# EAGLE design 48-pin (EAGLE 6.4)
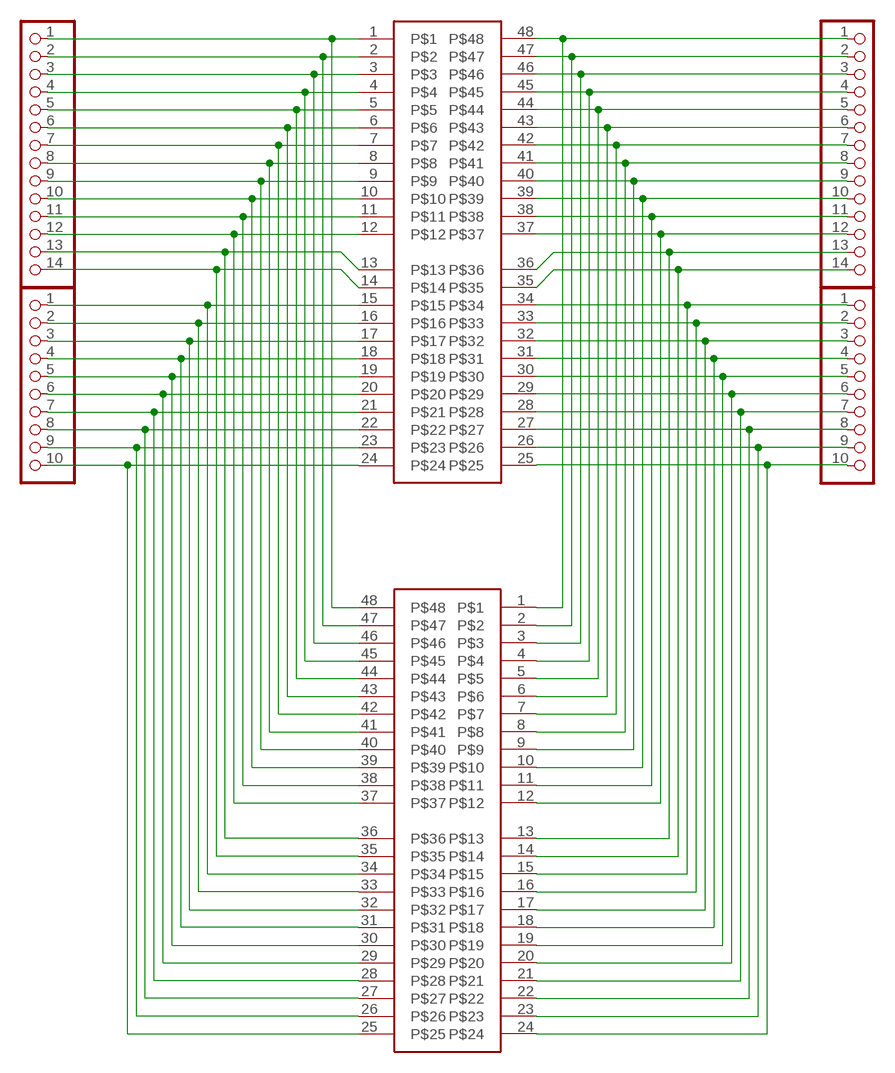
[diagram p0: schematic, sheet 1]

## Parts
JP1  PADS-14  [PADS-14]
JP2  PADS-14  [PADS-14]
JP3  PADS-10  [PADS-10]
JP4  PADS-10  [PADS-10]
U$1  BREAKOUTS_48-PINTQFP  [BREAKOUTS_TQFP48]
U$2  BREAKOUTS_48-PINQFN  [BREAKOUTS_QFN48]

## Nets
.05: JP4.6 U$1.29 U$2.20
N$1: JP1.1 U$1.1 U$2.48
N$2: JP1.2 U$1.2 U$2.47
N$3: JP1.3 U$1.3 U$2.46
N$4: JP1.4 U$1.4 U$2.45
N$5: JP1.5 U$1.5 U$2.44
N$6: JP1.6 U$1.6 U$2.43
N$7: JP1.7 U$1.7 U$2.42
N$8: JP1.8 U$1.8 U$2.41
N$9: JP1.9 U$1.9 U$2.40
N$10: JP1.10 U$1.10 U$2.39
N$11: JP1.11 U$1.11 U$2.38
N$12: JP1.12 U$1.12 U$2.37
N$13: JP3.1 U$1.15 U$2.34
N$14: JP3.2 U$1.16 U$2.33
N$15: JP3.3 U$1.17 U$2.32
N$16: JP3.4 U$1.18 U$2.31
N$17: JP3.5 U$1.19 U$2.30
N$18: JP3.6 U$1.20 U$2.29
N$19: JP3.7 U$1.21 U$2.28
N$20: JP3.8 U$1.22 U$2.27
N$21: JP3.9 U$1.23 U$2.26
N$22: JP3.10 U$1.24 U$2.25
N$23: JP2.1 U$1.48 U$2.1
N$24: JP2.2 U$1.47 U$2.2
N$25: JP2.3 U$1.46 U$2.3
N$26: JP2.4 U$1.45 U$2.4
N$27: JP2.5 U$1.44 U$2.5
N$28: JP2.6 U$1.43 U$2.6
N$29: JP2.7 U$1.42 U$2.7
N$30: JP2.8 U$1.41 U$2.8
N$32: JP2.10 U$1.39 U$2.10
N$33: JP2.11 U$1.38 U$2.11
N$34: JP2.12 U$1.37 U$2.12
N$35: JP4.1 U$1.34 U$2.15
N$36: JP4.2 U$1.33 U$2.16
N$37: JP4.3 U$1.32 U$2.17
N$38: JP4.4 U$1.31 U$2.18
N$39: JP4.5 U$1.30 U$2.19
N$41: JP4.7 U$1.28 U$2.21
N$42: JP4.8 U$1.27 U$2.22
N$43: JP4.9 U$1.26 U$2.23
N$44: JP4.10 U$1.25 U$2.24
N$45: JP1.14 U$1.14 U$2.35
N$46: JP2.14 U$1.35 U$2.14
N$47: JP2.13 U$1.36 U$2.13
N$48: JP1.13 U$1.13 U$2.36
N$49: JP2.9 U$1.40 U$2.9

## Library data of the parts
JP1 JP2 = breakouts:PADS-14: PIN HEADER
JP3 JP4 = breakouts:PADS-10: PIN HEADER
U$1 U$2 = fpp48-pin:BREAKOUTS_48-PIN

## Board
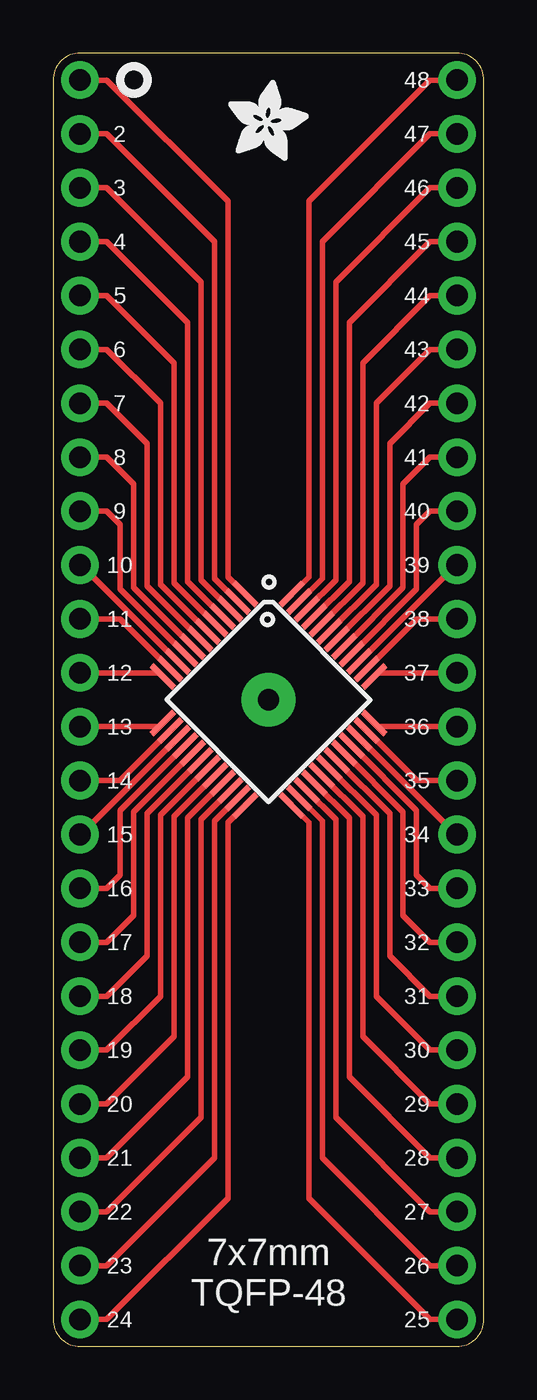
[diagram p1: board, top side]
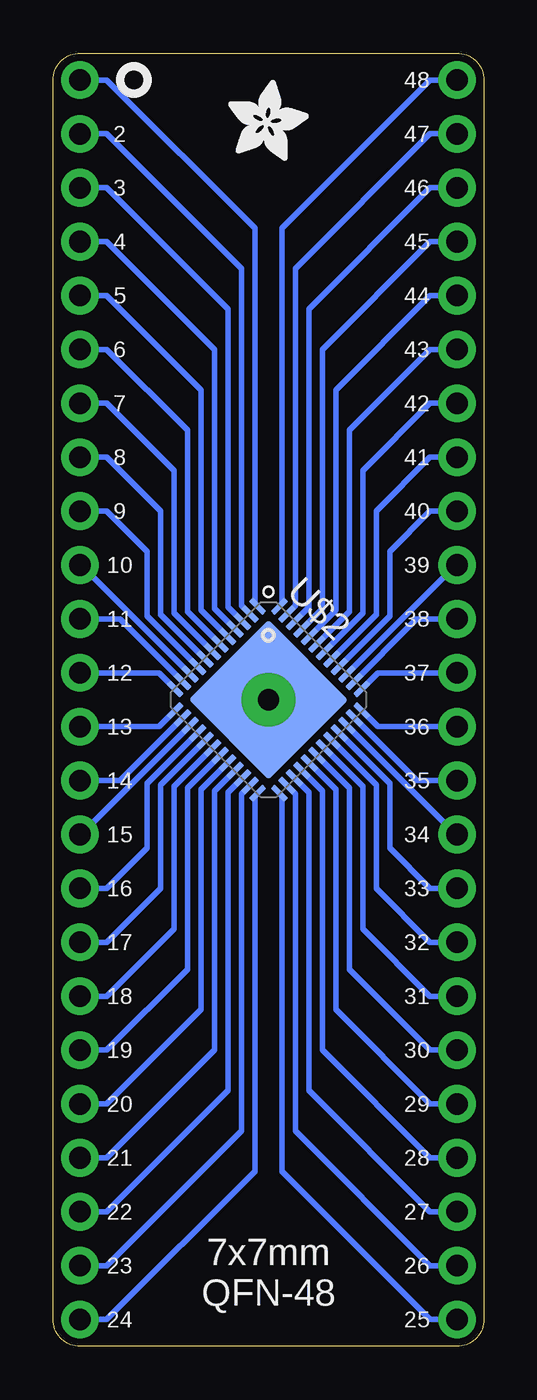
[diagram p2: board, bottom side, seen from below]

Size 20.32 x 60.96 mm. Coordinates in mm from the lower left corner, seen from the top.
Outline: 19.05,60.96 1.27,60.96 arc90 0,59.69 0,1.27 arc90 1.27,0 19.05,0 arc90 20.32,1.27 20.32,59.69 arc90 19.05,60.96
Copper layers (1*16): Top 0.035mm / dielectric 1.5mm / Bottom 0.035mm
Design rules "adafruit": minimum track width 8mil, minimum drill 15.5mil, track to track 8mil, track to pad 8mil, pad to pad 8mil, via to via 8mil, smd to smd 8mil, copper to edge 10mil, drill to drill 8mil, minimum pad ring 10mil, minimum via ring 8mil, stop-mask expansion 4mil, vias tented up to drill 20mil, thermal gap 10mil

### Footprints (pad centres in the part's own frame; a part is rotated, then mirrored left to right if it is on the bottom)
PADS-14 = drill 1.016 pad 1.778: 1 -16.51,0; 2 -13.97,0; 3 -11.43,0; 4 -8.89,0; 5 -6.35,0; 6 -3.81,0; 7 -1.27,0; 8 1.27,0; 9 3.81,0; 10 6.35,0; 11 8.89,0; 12 11.43,0; 13 13.97,0; 14 16.51,0
PADS-10 = drill 1.016 pad 1.778: 1 -11.43,0; 2 -8.89,0; 3 -6.35,0; 4 -3.81,0; 5 -1.27,0; 6 1.27,0; 7 3.81,0; 8 6.35,0; 9 8.89,0; 10 11.43,0
BREAKOUTS_TQFP48 = smd 1.5 x 0.275: 1 -4.3,2.75; 2 -4.3,2.25; 3 -4.3,1.75; 4 -4.3,1.25; 5 -4.3,0.75; 6 -4.3,0.25; 7 -4.3,-0.25; 8 -4.3,-0.75; 9 -4.3,-1.25; 10 -4.3,-1.75; 11 -4.3,-2.25; 12 -4.3,-2.75; 25 4.3,-2.75; 26 4.3,-2.25; 27 4.3,-1.75; 28 4.3,-1.25; 29 4.3,-0.75; 30 4.3,-0.25; 31 4.3,0.25; 32 4.3,0.75; 33 4.3,1.25; 34 4.3,1.75; 35 4.3,2.25; 36 4.3,2.75 | smd 0.275 x 1.5: 13 -2.75,-4.3; 14 -2.25,-4.3; 15 -1.75,-4.3; 16 -1.25,-4.3; 17 -0.75,-4.3; 18 -0.25,-4.3; 19 0.25,-4.3; 20 0.75,-4.3; 21 1.25,-4.3; 22 1.75,-4.3; 23 2.25,-4.3; 24 2.75,-4.3; 37 2.75,4.3; 38 2.25,4.3; 39 1.75,4.3; 40 1.25,4.3; 41 0.75,4.3; 42 0.25,4.3; 43 -0.25,4.3; 44 -0.75,4.3; 45 -1.25,4.3; 46 -1.75,4.3; 47 -2.25,4.3; 48 -2.75,4.3
BREAKOUTS_QFN48 = smd 0.9 x 0.275: 1 -3.475,2.75; 12 -3.475,-2.75; 25 3.475,-2.75; 36 3.475,2.75 | smd 0.95 x 0.275: 2 -3.475,2.25; 3 -3.475,1.75; 4 -3.475,1.25; 5 -3.475,0.75; 6 -3.475,0.25; 7 -3.475,-0.25; 8 -3.475,-0.75; 9 -3.475,-1.25; 10 -3.475,-1.75; 11 -3.475,-2.25; 26 3.475,-2.25; 27 3.475,-1.75; 28 3.475,-1.25; 29 3.475,-0.75; 30 3.475,-0.25; 31 3.475,0.25; 32 3.475,0.75; 33 3.475,1.25; 34 3.475,1.75; 35 3.475,2.25 | smd 0.275 x 0.9: 13 -2.75,-3.475; 24 2.75,-3.475; 37 2.75,3.475; 48 -2.75,3.475 | smd 0.275 x 0.95: 14 -2.25,-3.475; 15 -1.75,-3.475; 16 -1.25,-3.475; 17 -0.75,-3.475; 18 -0.25,-3.475; 19 0.25,-3.475; 20 0.75,-3.475; 21 1.25,-3.475; 22 1.75,-3.475; 23 2.25,-3.475; 38 2.25,3.475; 39 1.75,3.475; 40 1.25,3.475; 41 0.75,3.475; 42 0.25,3.475; 43 -0.25,3.475; 44 -0.75,3.475; 45 -1.25,3.475; 46 -1.75,3.475; 47 -2.25,3.475 | smd 5.309 x 5.309: EXP 0,0

### Placement (x,y rotation side)
JP1  1.27,43.18 270 top
JP2  19.05,43.18 270 top
JP3  1.27,12.7 270 top
JP4  19.05,12.7 270 top
U$1  10.16,30.48 315 top
U$2  10.16,30.48 315 bottom
U$3  [ADAFRUIT_3.5MM]  8.26,55.88 0 top
U$4  [ADAFRUIT_3.5MM]  12.06,55.88 0 bottom

### Tracks (layer width: path | path; a pad name or v marks a point on that pad's centre or on a via)
.05
  Top 0.254: JP4.6 17.78,11.43 14.61,14.61 14.61,24.97 U$1.29
  Bottom 0.254: U$2.20 13.34,26.24 13.34,15.88 17.78,11.43 JP4.6
N$1
  Top 0.254: U$1.1 8.26,36.27 8.26,53.98 2.54,59.69 JP1.1
  Bottom 0.254: U$2.48 9.53,35 9.53,52.7 2.54,59.69 JP1.1
N$2
  Top 0.254: U$1.2 7.62,36.2 7.62,52.07 2.54,57.15 JP1.2
  Bottom 0.254: U$2.47 8.89,34.93 8.89,50.8 2.54,57.15 JP1.2
N$3
  Top 0.254: U$1.3 6.99,36.13 6.99,50.16 2.54,54.61 JP1.3
  Bottom 0.254: U$2.46 8.26,34.86 8.26,47.62 8.26,48.26 8.26,48.9 2.54,54.61 JP1.3
N$4
  Top 0.254: U$1.4 6.35,36.06 6.35,48.26 2.54,52.07 JP1.4
  Bottom 0.254: U$2.45 7.62,34.79 7.62,45.72 7.62,46.35 7.62,46.99 2.54,52.07 JP1.4
N$5
  Top 0.254: U$1.5 5.71,35.99 5.71,46.35 2.54,49.53 JP1.5
  Bottom 0.254: U$2.44 6.99,34.72 6.99,45.09 2.54,49.53 JP1.5
N$6
  Top 0.254: U$1.6 5.08,35.91 5.08,44.45 2.54,46.99 JP1.6
  Bottom 0.254: U$2.43 6.35,34.64 6.35,43.18 2.54,46.99 JP1.6
N$7
  Top 0.254: U$1.7 4.45,35.84 4.45,42.55 2.54,44.45 JP1.7
  Bottom 0.254: U$2.42 5.71,34.57 5.71,40.01 5.71,40.64 5.71,41.27 2.54,44.45 JP1.7
N$8
  Top 0.254: U$1.8 3.81,35.77 3.81,40.64 2.54,41.91 JP1.8
  Bottom 0.254: U$2.41 5.08,34.5 5.08,37.47 5.08,38.73 5.08,39.37 2.54,41.91 JP1.8
N$9
  Top 0.254: U$1.9 3.17,35.7 3.17,38.73 2.54,39.37 JP1.9
  Bottom 0.254: U$2.40 4.45,34.43 4.45,37.47 2.54,39.37 JP1.9
N$10
  Top 0.254: U$1.10 1.33,36.83 JP1.10
  Bottom 0.254: U$2.39 1.33,36.83 JP1.10
N$11
  Top 0.254: U$1.11 3.17,34.29 JP1.11
  Bottom 0.254: U$2.38 6.34,31.11 6.35,31.11 3.17,34.29 JP1.11
N$12
  Top 0.254: U$1.12 5,31.75 JP1.12
  Bottom 0.254: U$2.37 5,31.75 JP1.12
N$13
  Top 0.254: JP3.1 1.33,24.13 U$1.15
  Bottom 0.254: U$2.34 1.33,24.13 JP3.1
N$14
  Top 0.254: JP3.2 2.54,21.59 3.17,22.23 3.17,25.26 U$1.16
  Bottom 0.254: U$2.33 4.45,26.53 4.45,23.5 2.54,21.59 JP3.2
N$15
  Top 0.254: JP3.3 2.54,19.05 3.81,20.32 3.81,25.19 U$1.17
  Bottom 0.254: U$2.32 5.08,26.46 5.08,21.59 2.54,19.05 JP3.3
N$16
  Top 0.254: JP3.4 2.54,16.51 4.45,18.41 4.45,25.12 U$1.18
  Bottom 0.254: U$2.31 5.71,26.39 5.71,19.68 2.54,16.51 JP3.4
N$17
  Top 0.254: JP3.5 2.54,13.97 5.08,16.51 5.08,25.05 U$1.19
  Bottom 0.254: U$2.30 6.35,26.32 6.35,17.78 2.54,13.97 JP3.5
N$18
  Top 0.254: JP3.6 2.54,11.43 5.71,14.61 5.71,24.97 U$1.20
  Bottom 0.254: U$2.29 6.99,26.24 6.99,15.88 2.54,11.43 JP3.6
N$19
  Top 0.254: JP3.7 2.54,8.89 6.35,12.7 6.35,24.9 U$1.21
  Bottom 0.254: U$2.28 7.62,26.17 7.62,13.97 2.54,8.89 JP3.7
N$20
  Top 0.254: JP3.8 2.54,6.35 6.99,10.79 6.99,24.83 U$1.22
  Bottom 0.254: U$2.27 8.26,26.1 8.26,12.06 2.54,6.35 JP3.8
N$21
  Top 0.254: JP3.9 2.54,3.81 7.62,8.89 7.62,24.76 U$1.23
  Bottom 0.254: U$2.26 8.89,26.03 8.89,10.16 2.54,3.81 JP3.9
N$22
  Top 0.254: JP3.10 2.54,1.27 8.26,6.99 8.26,24.69 U$1.24
  Bottom 0.254: U$2.25 9.53,25.96 9.53,8.26 2.54,1.27 JP3.10
N$23
  Top 0.254: JP2.1 17.78,59.69 12.06,53.98 12.06,36.27 U$1.48
  Bottom 0.254: U$2.1 10.79,35 10.79,52.7 17.78,59.69 JP2.1
N$24
  Top 0.254: JP2.2 17.78,57.15 12.7,52.07 12.7,36.2 U$1.47
  Bottom 0.254: U$2.2 11.43,34.93 11.43,50.8 17.78,57.15 JP2.2
N$25
  Top 0.254: JP2.3 17.78,54.61 13.34,50.16 13.34,36.13 U$1.46
  Bottom 0.254: U$2.3 12.06,34.86 12.06,48.9 17.78,54.61 JP2.3
N$26
  Top 0.254: JP2.4 17.78,52.07 13.97,48.26 13.97,36.06 U$1.45
  Bottom 0.254: U$2.4 12.7,34.79 12.7,46.99 17.78,52.07 JP2.4
N$27
  Top 0.254: JP2.5 17.78,49.53 14.61,46.35 14.61,35.99 U$1.44
  Bottom 0.254: U$2.5 13.34,34.72 13.34,45.09 17.78,49.53 JP2.5
N$28
  Top 0.254: JP2.6 17.78,46.99 15.24,44.45 15.24,35.91 U$1.43
  Bottom 0.254: U$2.6 13.97,34.64 13.97,43.18 17.78,46.99 JP2.6
N$29
  Top 0.254: JP2.7 17.78,44.45 15.88,42.55 15.88,35.84 U$1.42
  Bottom 0.254: U$2.7 14.61,34.57 14.61,41.27 17.78,44.45 JP2.7
N$30
  Top 0.254: JP2.8 17.78,41.91 16.51,40.64 16.51,35.77 U$1.41
  Bottom 0.254: U$2.8 15.24,34.5 15.24,39.37 17.78,41.91 JP2.8
N$31  (via drill 1 pad 2.54)
  other vias: 10.16,30.48
N$32
  Top 0.254: JP2.10 18.98,36.83 U$1.39
  Bottom 0.254: U$2.10 18.98,36.83 JP2.10
N$33
  Top 0.254: JP2.11 17.15,34.29 U$1.38
  Bottom 0.254: U$2.11 17.15,34.29 JP2.11
N$34
  Top 0.254: JP2.12 15.32,31.75 U$1.37
  Bottom 0.254: U$2.12 15.32,31.75 JP2.12
N$35
  Top 0.254: JP4.1 18.98,24.13 U$1.34
  Bottom 0.254: U$2.15 18.98,24.13 JP4.1
N$36
  Top 0.254: JP4.2 17.78,21.59 17.14,22.23 17.14,25.26 U$1.33
  Bottom 0.254: U$2.16 15.88,26.53 15.88,23.5 17.78,21.59 JP4.2
N$37
  Top 0.254: JP4.3 17.78,19.05 16.51,20.32 16.51,25.19 U$1.32
  Bottom 0.254: U$2.17 15.24,26.46 15.24,21.59 17.78,19.05 JP4.3
N$38
  Top 0.254: JP4.4 17.78,16.51 15.88,18.41 15.88,25.12 U$1.31
  Bottom 0.254: U$2.18 14.61,26.39 14.61,19.68 17.78,16.51 JP4.4
N$39
  Top 0.254: JP4.5 17.78,13.97 15.24,16.51 15.24,25.05 U$1.30
  Bottom 0.254: U$2.19 13.97,26.32 13.97,17.78 17.78,13.97 JP4.5
N$41
  Top 0.254: JP4.7 17.78,8.89 13.97,12.7 13.97,24.9 U$1.28
  Bottom 0.254: U$2.21 12.7,26.17 12.7,13.97 17.78,8.89 JP4.7
N$42
  Top 0.254: JP4.8 17.78,6.35 13.34,10.79 13.34,24.83 U$1.27
  Bottom 0.254: U$2.22 12.06,26.1 12.06,12.06 17.78,6.35 JP4.8
N$43
  Top 0.254: JP4.9 17.78,3.81 12.7,8.89 12.7,24.76 U$1.26
  Bottom 0.254: U$2.23 11.43,26.03 11.43,10.16 17.78,3.81 JP4.9
N$44
  Top 0.254: JP4.10 17.78,1.27 12.06,6.99 12.06,24.69 U$1.25
  Bottom 0.254: U$2.24 10.79,25.96 10.79,8.26 17.78,1.27 JP4.10
N$45
  Top 0.254: JP1.14 3.17,26.67 U$1.14
  Bottom 0.254: U$2.35 3.17,26.67 JP1.14
N$46
  Top 0.254: JP2.14 17.15,26.67 U$1.35
  Bottom 0.254: U$2.14 17.15,26.67 JP2.14
N$47
  Top 0.254: JP2.13 15.32,29.21 U$1.36
  Bottom 0.254: U$2.13 15.32,29.21 JP2.13
N$48
  Top 0.254: JP1.13 5,29.21 U$1.13
  Bottom 0.254: U$2.36 5,29.21 JP1.13
N$49
  Top 0.254: JP2.9 17.78,39.37 17.14,38.73 17.14,35.7 U$1.40
  Bottom 0.254: U$2.9 15.88,34.43 15.88,37.47 17.78,39.37 JP2.9

### Text on the board
tPlace: 48 | 2 | 47 | 3 | 46 | 4 | 45 | 5 | 44 | 6 | 43 | 7 | 42 | 8 | 41 | 9 | 40 | 10 | 39 | 11 | 38 | 12 | 37 | 13 | 36 | 14 | 35 | 15 | 34 | 16 | 33 | 17 | 32 | 18 | 31 | 19 | 30 | 20 | 29 | 21 | 28 | 22 | 27 | 23 | 7x7mm | 26 | TQFP-48 | 24 | 25
bPlace: 48 | 47 | 2 | 46 | 3 | 45 | 4 | 44 | 5 | 43 | 6 | 42 | 7 | 41 | 8 | 40 | 9 | 39 | 10 | 38 | 11 | 37 | 12 | 36 | 13 | 35 | 14 | 34 | 15 | 33 | 16 | 32 | 17 | 31 | 18 | 30 | 19 | 29 | 20 | 28 | 21 | 27 | 22 | 26 | 7x7mm | 23 | QFN-48 | 25 | 24